# EAGLE design TLF01 (EAGLE 9.0.1)
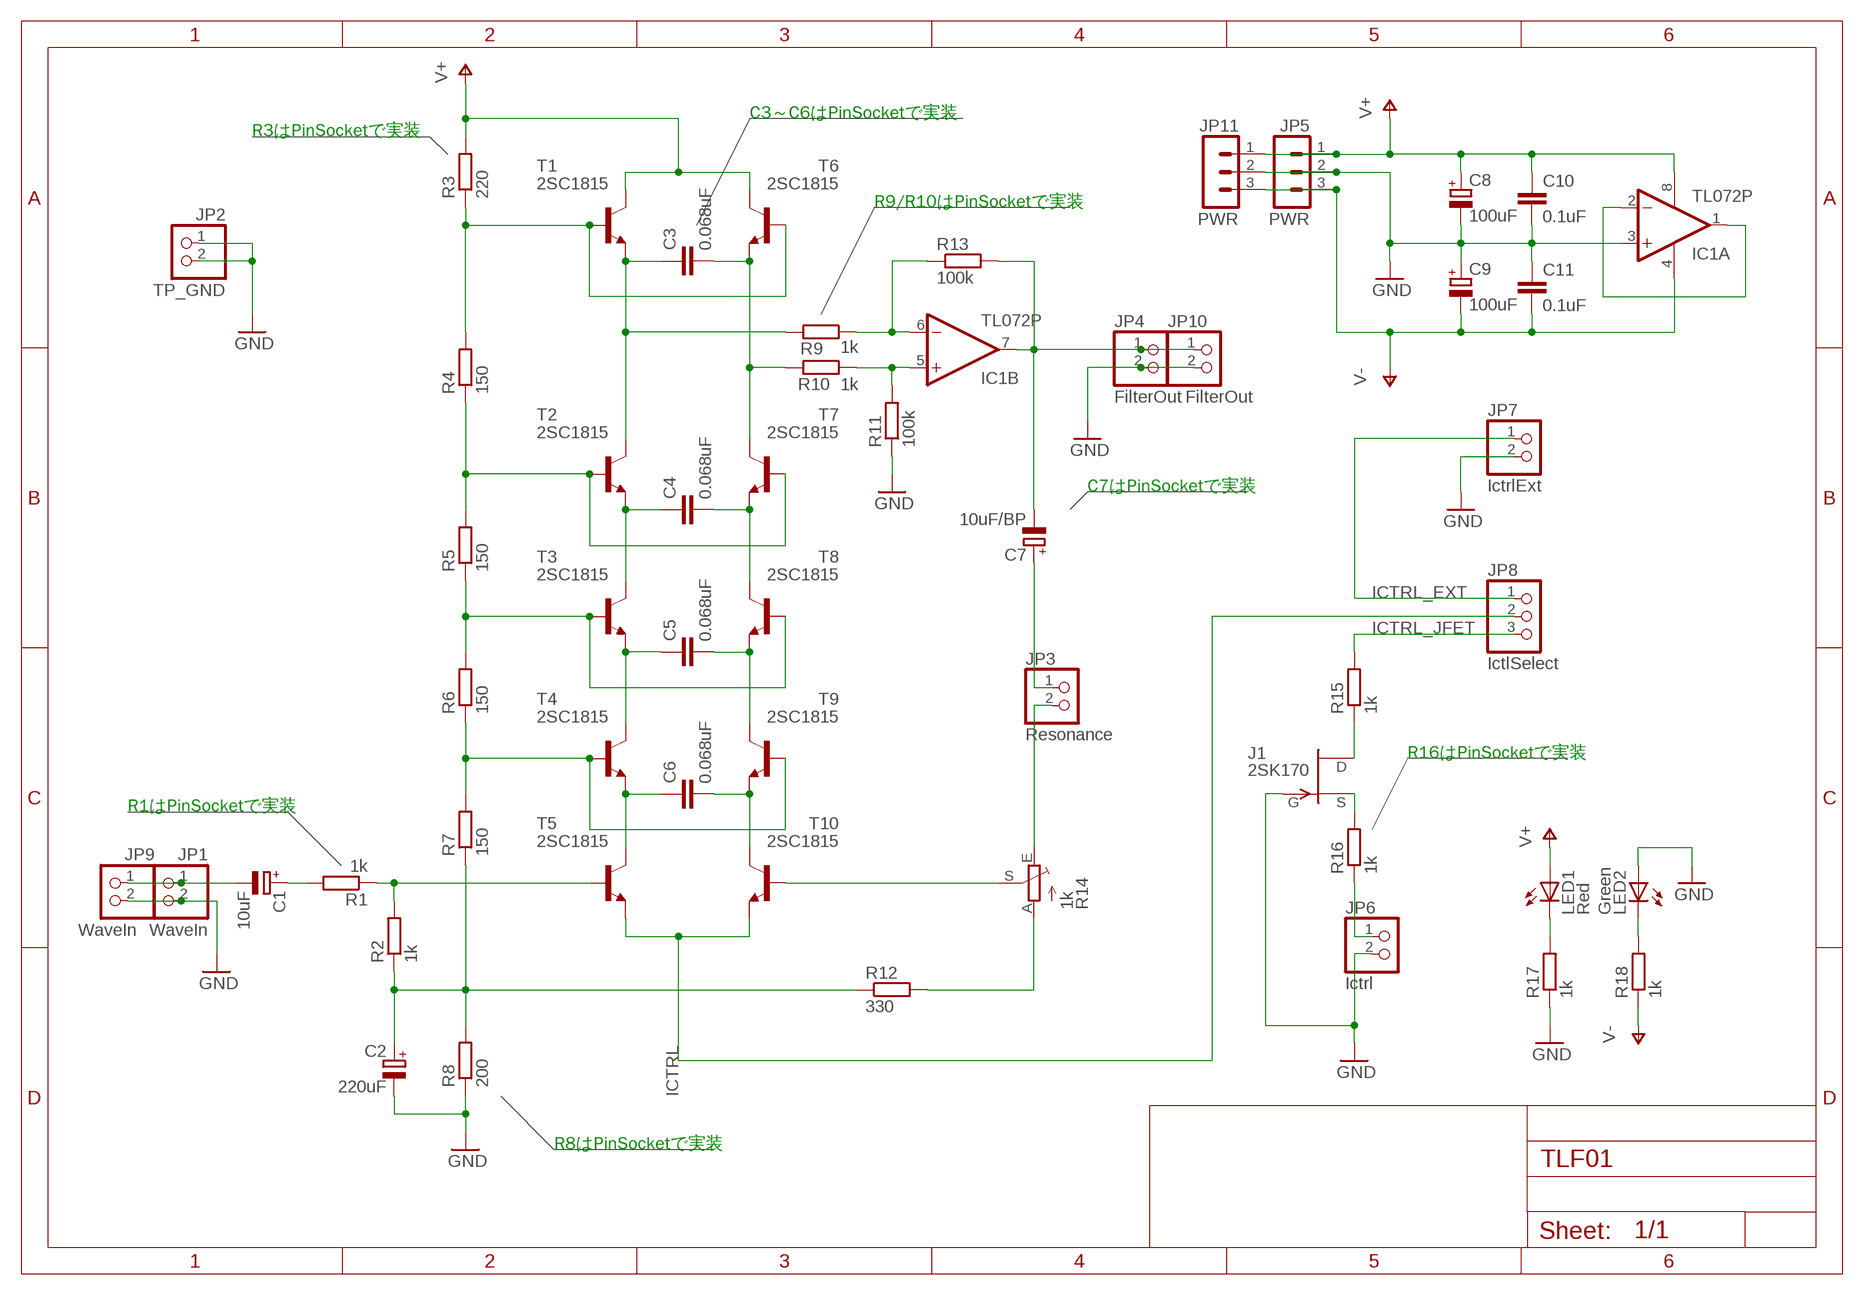
[diagram p0: schematic, sheet 1]

## Parts
C1  10uF  CPOL-EUE2.5-6  [E2,5-6]
C2  220uF  CPOL-EUE5-8.5  [E5-8,5]
C3  0.068uF  C-EU075-052X106  [C075-052X106]
C4  0.068uF  C-EU075-052X106  [C075-052X106]
C5  0.068uF  C-EU075-052X106  [C075-052X106]
C6  0.068uF  C-EU075-052X106  [C075-052X106]
C7  10uF/BP  CPOL-EUE5-8.5  [E5-8,5]
C8  100uF  CPOL-EUE2.5-7  [E2,5-7]
C9  100uF  CPOL-EUE2.5-7  [E2,5-7]
C10  0.1uF  C-EU025-025X050  [C025-025X050]
C11  0.1uF  C-EU025-025X050  [C025-025X050]
IC1  TL072P  [DIL08]
J1  2SK170  [TO-92]
JP1  WaveIn  PINHD-1X2  [1X02]
JP2  TP_GND  PINHD-1X2  [1X02]
JP3  Resonance  PINHD-1X2  [1X02]
JP4  FilterOut  PINHD-1X2  [1X02]
JP5  PWR  B3B-EH-A  [B3B-EH-A]
JP6  Ictrl  PINHD-1X2  [1X02]
JP7  IctrlExt  PINHD-1X2  [1X02]
JP8  IctlSelect  PINHD-1X3  [1X03]
JP9  WaveIn  PINHD-1X2  [1X02]
JP10  FilterOut  PINHD-1X2  [1X02]
JP11  PWR  B3B-EH-A  [B3B-EH-A]
LED1  Red  LED3MM  [LED3MM]
LED2  Green  LED3MM  [LED3MM]
R1  1k  R-EU_0207/7  [0207/7]
R2  1k  R-EU_0207/7  [0207/7]
R3  220  R-EU_0207/7  [0207/7]
R4  150  R-EU_0207/7  [0207/7]
R5  150  R-EU_0207/7  [0207/7]
R6  150  R-EU_0207/7  [0207/7]
R7  150  R-EU_0207/7  [0207/7]
R8  200  R-EU_0207/7  [0207/7]
R9  1k  R-EU_0207/7  [0207/7]
R10  1k  R-EU_0207/7  [0207/7]
R11  100k  R-EU_0207/7  [0207/7]
R12  330  R-EU_0207/7  [0207/7]
R13  100k  R-EU_0207/7  [0207/7]
R14  1k  TRIM_EU-B25P  [B25P]
R15  1k  R-EU_0207/7  [0207/7]
R16  1k  R-EU_0207/7  [0207/7]
R17  1k  R-EU_0207/7  [0207/7]
R18  1k  R-EU_0207/7  [0207/7]
T1  2SC1815  -NPN-TO92-ECB  [TO92-ECB]
T2  2SC1815  -NPN-TO92-ECB  [TO92-ECB]
T3  2SC1815  -NPN-TO92-ECB  [TO92-ECB]
T4  2SC1815  -NPN-TO92-ECB  [TO92-ECB]
T5  2SC1815  -NPN-TO92-ECB  [TO92-ECB]
T6  2SC1815  -NPN-TO92-ECB  [TO92-ECB]
T7  2SC1815  -NPN-TO92-ECB  [TO92-ECB]
T8  2SC1815  -NPN-TO92-ECB  [TO92-ECB]
T9  2SC1815  -NPN-TO92-ECB  [TO92-ECB]
T10  2SC1815  -NPN-TO92-ECB  [TO92-ECB]

## Nets
GND: C2.- C8.- C9.+ C10.2 C11.1 IC1.3(A:+IN) J1.2(G) JP1.2 JP2.1 JP2.2 JP4.2 JP5.2 JP6.2 JP7.2 JP9.2 JP10.2 JP11.2 LED2.A R8.1 R11.1 R17.1
ICTRL: JP8.2 T5.E T10.E
ICTRL_EXT: JP7.1 JP8.1
ICTRL_JFET: JP8.3 R15.2
N$1: LED1.K(C) R17.2
N$2: C3.1 R9.2 T1.E T2.C
N$3: C3.2 R10.2 T6.E T7.C
N$4: C4.1 T2.E T3.C
N$5: C4.2 T7.E T8.C
N$6: C5.1 T3.E T4.C
N$7: C5.2 T8.E T9.C
N$8: C6.1 T4.E T5.C
N$9: C6.2 T9.E T10.C
N$10: J1.1(D) R15.1
N$11: R6.1 R7.2 T4.B T9.B
N$12: R5.1 R6.2 T3.B T8.B
N$13: R4.1 R5.2 T2.B T7.B
N$14: C1.+ R1.2
N$15: R12.2 R14.A
N$16: IC1.1(A:OUT) IC1.2(A:-IN)
N$17: IC1.6(B:-IN) R9.1 R13.1
N$18: IC1.5(B:+IN) R10.1 R11.2
N$19: J1.3(S) R16.2
N$20: C7.- IC1.7(B:OUT) JP4.1 JP10.1 R13.2
N$21: R14.S T10.B
N$22: C7.+ JP3.1
N$23: JP3.2 R14.E
N$24: C2.+ R2.1 R7.1 R8.2 R12.1
N$25: JP6.1 R16.1
N$27: C1.- JP1.1 JP9.1
N$28: R1.1 R2.2 T5.B
N$29: LED2.K(C) R18.2
N$31: R3.1 R4.2 T1.B T6.B
V+: C8.+ C10.1 IC1.8(P:V+) JP5.1 JP11.1 LED1.A R3.2 T1.C T6.C
V-: C9.- C11.2 IC1.4(P:V-) JP5.3 JP11.3 R18.1

## Notes on the sheet
- C3～C6はPinSocketで実装
- R3はPinSocketで実装
- R9/R10はPinSocketで実装
- C7はPinSocketで実装
- R16はPinSocketで実装
- R1はPinSocketで実装
- R8はPinSocketで実装

## Library data of the parts
C1 C2 C7-C9 = rcl:CPOL-EU: POLARIZED CAPACITOR, European symbol; SPICEPREFIX: C
C3-C6 C10 C11 = rcl:C-EU: CAPACITOR, European symbol; SPICEPREFIX: C
IC1 = linear:TL072: OP AMP
J1 = toshiba-jfet:2SK170
JP1-JP4 JP6 JP7 JP9 JP10 = pinhead:PINHD-1X2: PIN HEADER
JP5 JP11 = con-jst-eh:B3B-EH-A: HEADER
JP8 = pinhead:PINHD-1X3: PIN HEADER
LED1 LED2 = led:LED: LED OSRAM: - CHIPLED LG R971, LG N971, LY N971, LG Q971, LY Q971, LO R971, LY R971 LH N974, LH R974 LS Q976, LO Q976, LY Q976 LO Q996 - Hyper CHIPLED LW Q18S LB Q993, LB Q99A, LB R99A - SideLED LS A670, LO A670, LY A670, LG A670, LP A670 LB A673, LV A673, LT A673, LW A673 LH A674 LY A675 LS A676, LA A676, LO A676, LY A676, LW A676 LS A679, LY A679, LG A679 - Hyper Micro SIDELED® LS Y876, LA Y876, LO Y876, LY Y876 LT Y87S - SmartLED LW L88C, LW L88S LB L89C, LB L89S, LG L890 LS L89K, LO L89K, LY L89K LS L896, LA L896, LO L896, LY L896 - TOPLED LS T670, LO T670, LY T670, LG T670, LP T670 LSG T670, LSP T670, LSY T670, LOP T670, LYG T670 LG T671, LOG T671, LSG T671 LB T673, LV T673, LT T673, LW T673 LH T674 LS T676, LA T676, LO T676, LY T676, LB T676, LH T676, LSB T676, LW T676 LB T67C, LV T67C, LT T67C, LS T67K, LO T67K, LY T67K, LW E67C LS E67B, LA E67B, LO E67B, LY E67B, LB E67C, LV E67C, LT E67C LW T67C LS T679, LY T679, LG T679 LS T770, LO T770, LY T770, LG T770, LP T770 LB T773, LV T773, LT T773, LW T773 LH T774 LS E675, LA E675, LY E675, LS T675 LS T776, LA T776, LO T776, LY T776, LB T776 LHGB T686 LT T68C, LB T68C - Hyper Mini TOPLED® LB M676 - Mini TOPLED Santana® LG M470 LS M47K, LO M47K, LY M47K Source: http://www.osram.convergy.de LUXEON: - LUMILED® LXK2-PW12-R00, LXK2-PW12-S00, LXK2-PW14-U00, LXK2-PW14-V00 LXK2-PM12-R00, LXK2-PM12-S00, LXK2-PM14-U00 LXK2-PE12-Q00, LXK2-PE12-R00, LXK2-PE12-S00, LXK2-PE14-T00, LXK2-PE14-U00 LXK2-PB12-K00, LXK2-PB12-L00, LXK2-PB12-M00, LXK2-PB14-N00, LXK2-PB14-P00, LXK2-PB14-Q00 LXK2-PR12-L00, LXK2-PR12-M00, LXK2-PR14-Q00, LXK2-PR14-R00 LXK2-PD12-Q00, LXK2-PD12-R00, LXK2-PD12-S00 LXK2-PH12-R00, LXK2-PH12-S00 LXK2-PL12-P00, LXK2-PL12-Q00, LXK2-PL12-R00 Source: www.luxeon.com KINGBRIGHT: KA-3528ASYC Source: www.kingbright.com
R1-R13 R15-R18 = rcl:R-EU_: RESISTOR, European symbol; SPICEPREFIX: R
R14 = pot:TRIM_EU-: POTENTIOMETER
T1-T10 = transistor:*-NPN-: NPN Transistror BF959 corrected 2008.03.06

## Board
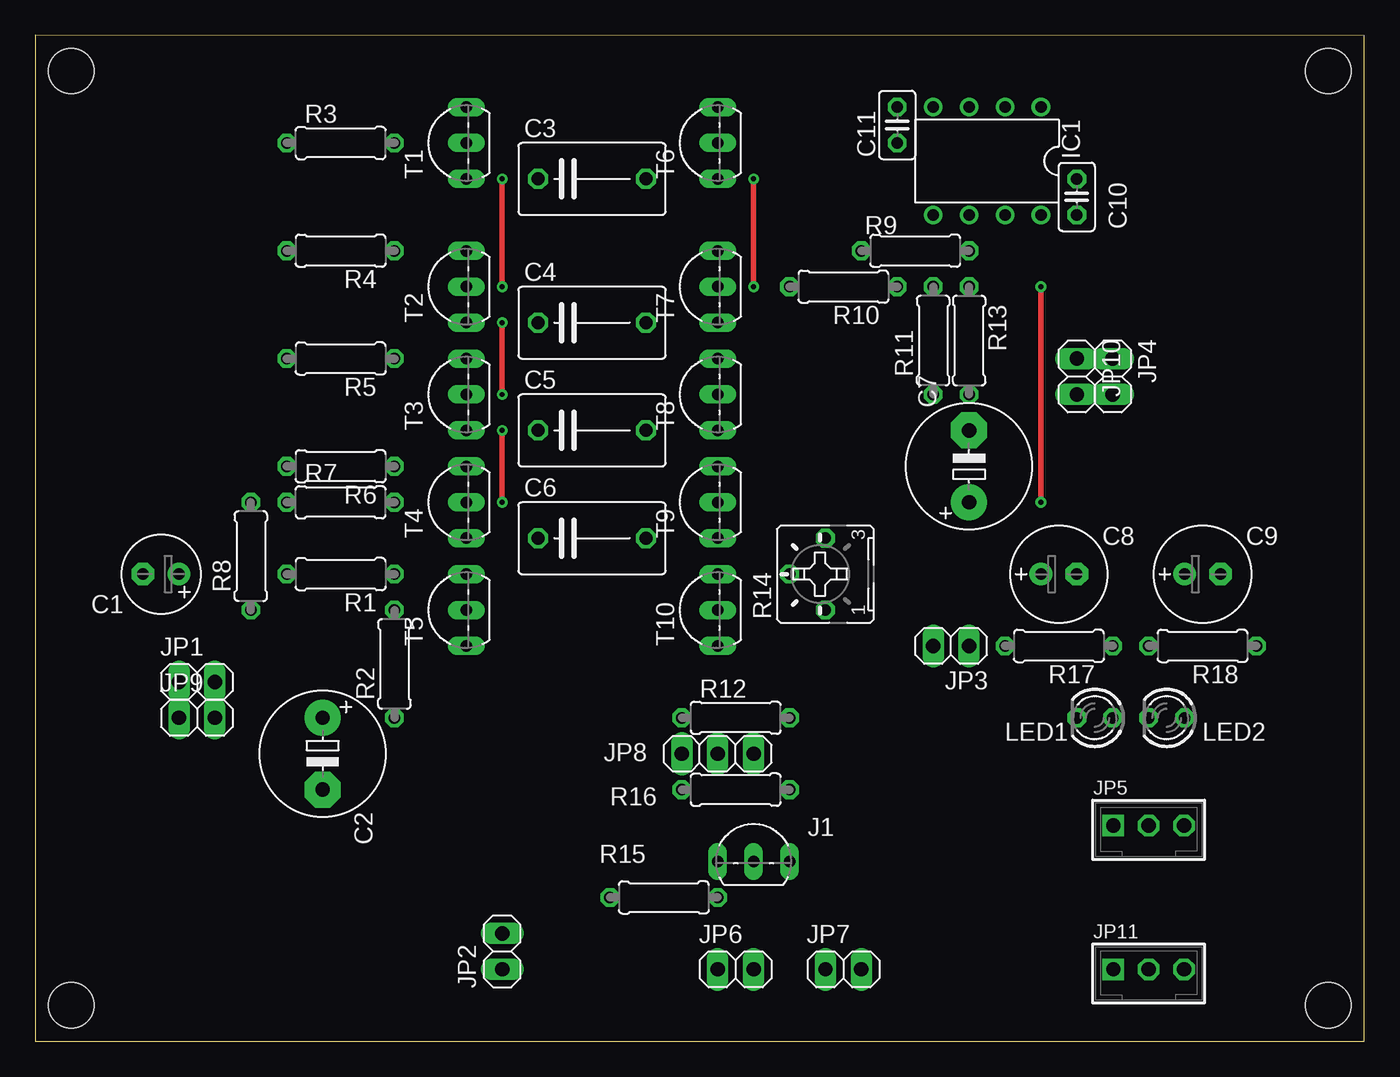
[diagram p1: board, top side]
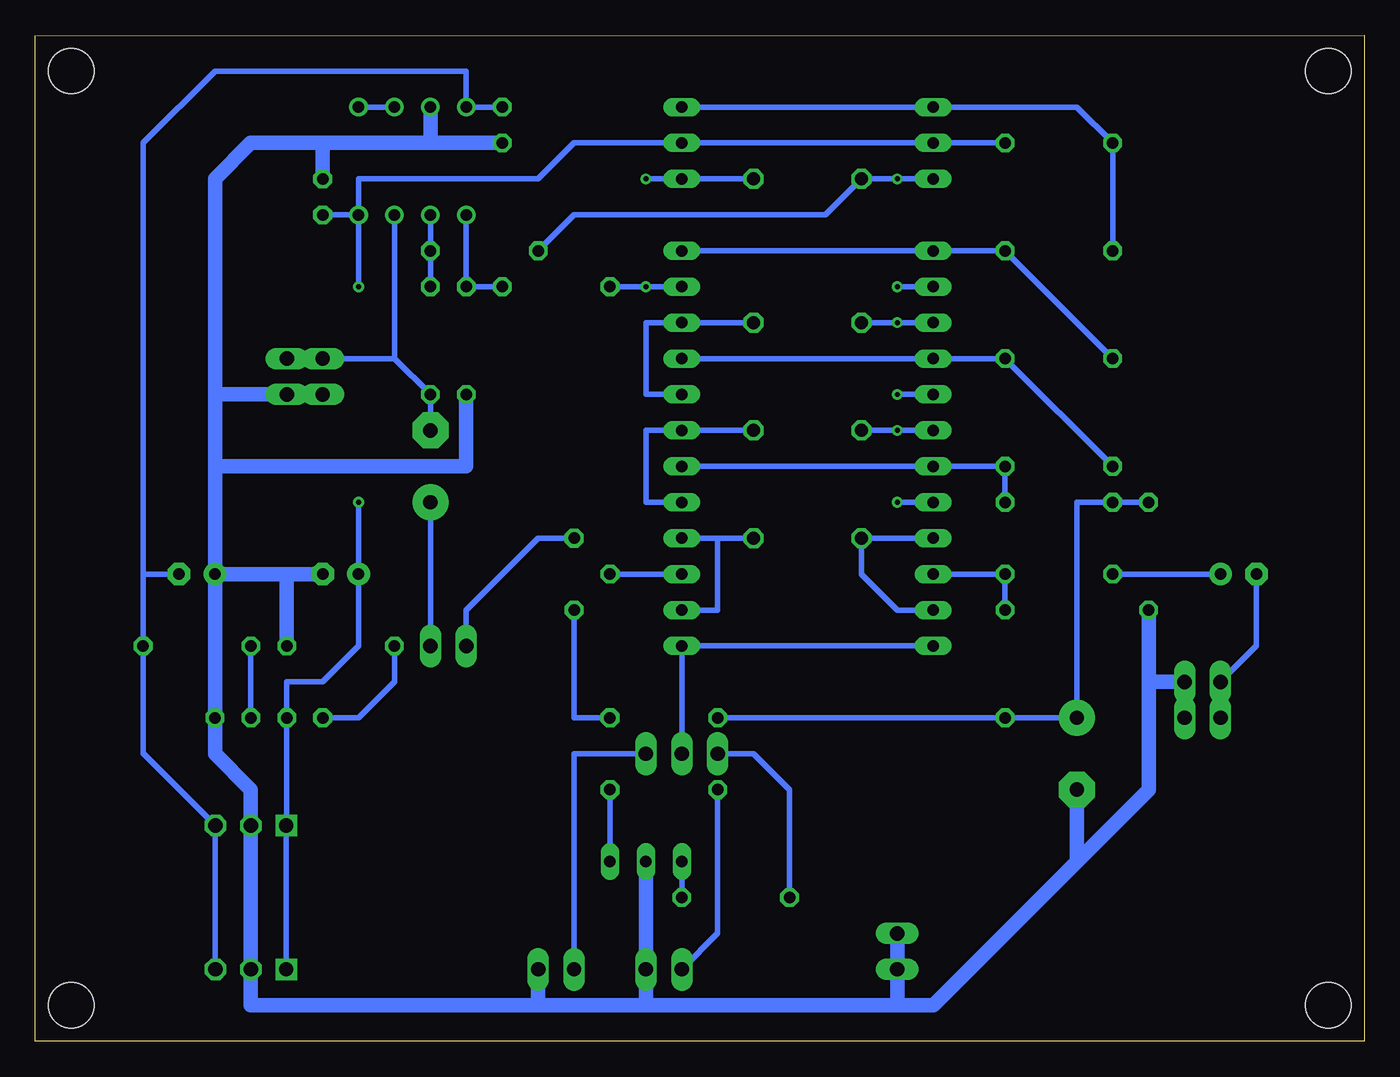
[diagram p2: board, bottom side, seen from below]

Size 93.98 x 71.13 mm. Coordinates in mm from the lower left corner, seen from the top.
Outline: 0,0.02 93.98,0 93.98,71.11 0,71.13 0,0.02
Copper layers (1*16): Top 0.035mm / dielectric 1.5mm / Bottom 0.035mm
Design rules "default": minimum track width 6mil, minimum drill 0.35mm, track to track 6mil, track to pad 6mil, pad to pad 6mil, via to via 6mil, smd to smd 6mil, copper to edge 40mil, drill to drill 6mil, minimum pad ring 10mil, minimum via ring 8mil, stop-mask expansion 4mil, vias tented up to drill 0mil, thermal gap 10mil
Holes 3.2 mm at 2.54,68.6 2.54,2.56 91.44,2.56 91.44,68.6

### Footprints (pad centres in the part's own frame; a part is rotated, then mirrored left to right if it is on the bottom)
E2,5-6 = drill 0.813 pad 1.6: + -1.27,0 | drill 0.813 pad 1.6 octagon: - 1.27,0
E5-8,5 = drill 1.016 pad 2.54: + -2.54,0 | drill 1.016 pad 2.54 octagon: - 2.54,0
C075-052X106 = drill 0.914 octagon: 1 -3.81,0; 2 3.81,0
E2,5-7 = drill 0.813 pad 1.6: + -1.27,0 | drill 0.813 pad 1.6 octagon: - 1.27,0
C025-025X050 = drill 0.813 octagon: 1 -1.27,0; 2 1.27,0
DIL08 = drill 0.813 pad 1.27: 1 -3.81,-3.81; 2 -1.27,-3.81; 3 1.27,-3.81; 4 3.81,-3.81; 5 3.81,3.81; 6 1.27,3.81; 7 -1.27,3.81; 8 -3.81,3.81
TO-92 = drill 0.813 long: 1 -2.54,0; 2 0,0; 3 2.54,0
1X02 = drill 1.016 long: 1 -1.27,0; 2 1.27,0
B3B-EH-A = drill 1.016 square: 1 -2.5,0 | drill 1.016 octagon: 2 0,0; 3 2.5,0
1X03 = drill 1.016 long: 1 -2.54,0; 2 0,0; 3 2.54,0
LED3MM = drill 0.813 octagon: A -1.27,0; K 1.27,0
0207/7 = drill 0.813 octagon: 1 -3.81,0; 2 3.81,0
B25P = drill 0.813 octagon: A -2.54,0; E 2.54,0; S 0,2.54
TO92-ECB = drill 0.813 long: B 2.54,0; C 0,0; E -2.54,0

### Placement (x,y rotation side)
C1  8.89,33.04 180 top
C2  20.32,20.34 270 top
C3  39.37,60.98 0 top
C4  39.37,50.82 0 top
C5  39.37,43.2 0 top
C6  39.37,35.58 0 top
C7  66.04,40.66 90 top
C8  72.39,33.04 0 top
C9  82.55,33.04 0 top
C10  73.66,59.71 90 top
C11  60.96,64.79 90 top
IC1  67.31,62.25 180 top
J1  50.8,12.72 0 top
JP1  11.43,25.42 0 top
JP2  33.02,6.37 90 top
JP3  64.77,27.96 180 top
JP4  76.2,47.01 270 top
JP5  78.74,15.26 0 top
JP6  49.53,5.1 0 top
JP7  57.15,5.1 0 top
JP8  48.26,20.34 180 top
JP9  11.43,22.88 0 top
JP10  73.66,47.01 270 top
JP11  78.74,5.1 0 top
LED1  74.93,22.88 180 top
LED2  80.01,22.88 180 top
R1  21.59,33.04 180 top
R2  25.4,26.69 90 top
R3  21.59,63.52 0 top
R4  21.59,55.9 180 top
R5  21.59,48.28 180 top
R6  21.59,40.66 180 top
R7  21.59,38.12 0 top
R8  15.24,34.31 90 top
R9  62.23,55.9 180 top
R10  57.15,53.36 180 top
R11  63.5,49.55 90 top
R12  49.53,22.88 0 top
R13  66.04,49.55 270 top
R14  55.88,33.04 90 top
R15  44.45,10.18 180 top
R16  49.53,17.8 0 top
R17  72.39,27.96 180 top
R18  82.55,27.96 180 top
T1  30.48,63.52 90 top
T2  30.48,53.36 90 top
T3  30.48,45.74 90 top
T4  30.48,38.12 90 top
T5  30.48,30.5 90 top
T6  48.26,63.52 90 top
T7  48.26,53.36 90 top
T8  48.26,45.74 90 top
T9  48.26,38.12 90 top
T10  48.26,30.5 90 top

### Tracks (layer width: path | path; a pad name or v marks a point on that pad's centre or on a via)
GND
  Bottom 1.016: C8.- 76.2,33.04 | 76.2,33.04 C9.+ | C9.+ LED2.A 81.28,20.34 78.74,17.8 JP5.2 JP11.2 78.74,2.56 58.42,2.56 | C11.1 66.04,63.52 | IC1.3 66.04,63.52 | C9.+ 81.28,40.66 | 81.28,40.66 81.28,45.74 | 81.28,45.74 81.28,60.98 78.74,63.52 73.66,63.52 | 73.66,63.52 66.04,63.52 | C10.2 73.66,63.52 | JP10.2 JP4.2 81.28,45.74 | R17.1 76.2,33.04 | R11.1 63.5,40.66 81.28,40.66 | JP9.2 JP1.2 15.24,25.42 | 20.32,12.72 30.48,2.56 33.02,2.56 | 33.02,2.56 50.8,2.56 | 50.8,2.56 58.42,2.56 | 50.8,2.56 JP6.2 J1.2 | JP7.2 58.42,2.56 | C2.- 20.32,12.72 | 33.02,2.56 JP2.1 JP2.2 | R8.1 15.24,25.42 | 15.24,25.42 15.24,17.8 20.32,12.72
ICTRL
  Bottom 0.406: T5.E T10.E JP8.2
ICTRL_EXT
  Bottom 0.406: JP7.1 55.88,20.34 JP8.1
ICTRL_JFET
  Bottom 0.406: R15.2 40.64,17.8 43.18,20.34 JP8.3
N$1
  Bottom 0.406: R17.2 68.58,25.42 71.12,22.88 LED1.K
N$2  (via drill 0.35)
  Top 0.406: v33.02,60.98 v33.02,53.36
  Bottom 0.406: T1.E v33.02,60.98 C3.1 38.1,58.44 55.88,58.44 R9.2 | v33.02,53.36 T2.C
N$3  (via drill 0.35)
  Top 0.406: v50.8,60.98 v50.8,53.36
  Bottom 0.406: C3.2 T6.E v50.8,60.98 | T7.C v50.8,53.36 R10.2
N$4  (via drill 0.35)
  Top 0.406: v33.02,50.82 v33.02,45.74
  Bottom 0.406: T2.E v33.02,50.82 C4.1 | v33.02,45.74 T3.C
N$5
  Bottom 0.406: C4.2 T7.E 50.8,50.82 50.8,45.74 T8.C
N$6  (via drill 0.35)
  Top 0.406: v33.02,43.2 v33.02,38.12
  Bottom 0.406: T3.E v33.02,43.2 C5.1 | v33.02,38.12 T4.C
N$7
  Bottom 0.406: C5.2 T8.E 50.8,43.2 50.8,38.12 T9.C
N$8
  Bottom 0.406: T4.E C6.1 35.56,33.04 33.02,30.5 T5.C
N$9
  Bottom 0.406: C6.2 45.72,35.58 | 45.72,35.58 T9.E | T10.C 45.72,30.5 45.72,35.58
N$10
  Bottom 0.406: R15.1 J1.1
N$11
  Bottom 0.406: R7.2 R6.1 T4.B T9.B
N$12
  Bottom 0.406: R6.2 R5.1 T3.B T8.B
N$13
  Bottom 0.406: T7.B T2.B R4.1 R5.2
N$14
  Bottom 0.406: R1.2 C1.+
N$15
  Bottom 0.406: R14.A 55.88,22.88 R12.2
N$16
  Bottom 0.406: IC1.2 IC1.1
N$17
  Bottom 0.406: IC1.6 R9.1 R13.1
N$18
  Bottom 0.406: IC1.5 R11.2 R10.1
N$19
  Bottom 0.406: R16.2 J1.3
N$20
  Bottom 0.406: C7.- R13.2 68.58,48.28 | IC1.7 68.58,48.28 | 68.58,48.28 JP10.1 JP4.1
N$21
  Bottom 0.406: T10.B R14.S
N$22
  Bottom 0.406: C7.+ JP3.1
N$23
  Bottom 0.406: R14.E 58.42,35.58 63.5,30.5 JP3.2
N$24
  Bottom 0.406: R8.2 R7.1 20.32,38.12 C2.+ R2.1 R12.1
N$25
  Bottom 0.406: R16.1 45.72,7.64 JP6.1
N$27
  Bottom 0.406: JP9.1 JP1.1 7.62,27.96 C1.-
N$28
  Bottom 0.406: T5.B R1.1 R2.2
N$29
  Bottom 0.406: R18.2 LED2.K
N$31
  Bottom 0.406: T6.B T1.B 20.32,66.06 R3.1 R4.2
V+  (via drill 0.35)
  Top 0.406: v71.12,38.12 v71.12,53.36
  Bottom 0.406: JP11.1 JP5.1 76.2,15.3 LED1.A 76.2,25.42 73.66,25.42 71.12,27.96 C8.+ v71.12,38.12 | C10.1 IC1.8 | IC1.8 71.12,60.98 58.42,60.98 55.88,63.52 T6.C T1.C R3.2 | v71.12,53.36 IC1.8
V-
  Bottom 0.406: 86.36,33.04 R18.1 86.36,20.34 86.32,20.34 JP5.3 81.28,15.26 81.28,5.14 JP11.3 | 86.36,33.04 86.36,63.52 81.28,68.6 63.5,68.6 IC1.4 C11.2 | C9.- 86.36,33.04

### Text on the board
tDocu: はピンソケットで実装 | http://dad8893.blogspot.com/ | TLF01